# Altium project Pinger.PrjPcb
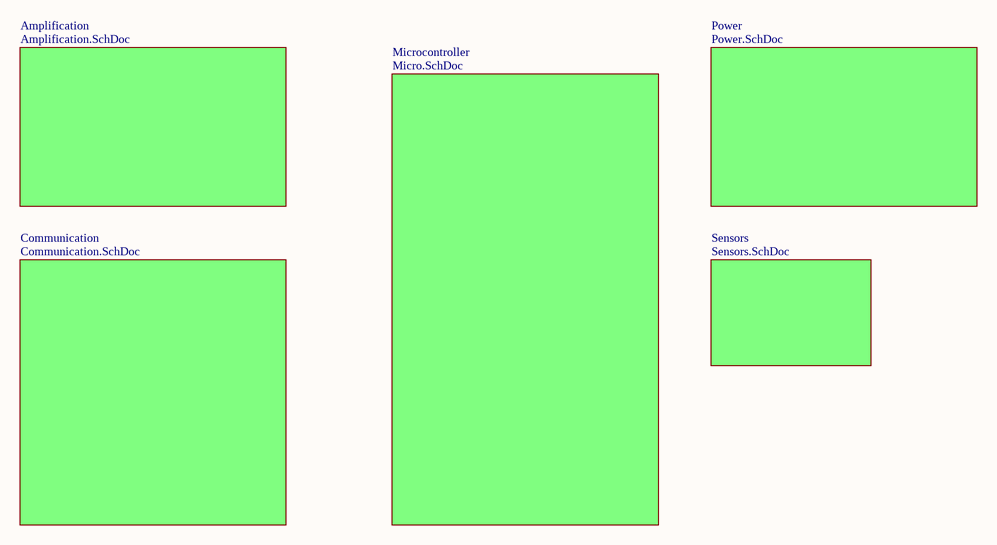
[diagram p0: Master.SchDoc]
Project: Pinger V2
6 sheets, 20 parts. Net scope: flat (ports and power ports of the same name join across sheets).
Board file: Pinger PCB Rev A.PcbDoc
Sheets:
  Master.SchDoc
    Amplification = Amplification.SchDoc
    Microcontroller = Micro.SchDoc
    Power = Power.SchDoc
    Sensors = Sensors.SchDoc
    Communication = Communication.SchDoc

## Sheet Master.SchDoc
size 431 x 279 mm; SheetNumber: 1; SheetTotal: 6

### Sub-sheets
Amplification = Amplification.SchDoc: no entries
Communication = Communication.SchDoc: no entries
Microcontroller = Micro.SchDoc: no entries
Power = Power.SchDoc: no entries
Sensors = Sensors.SchDoc: no entries

### Notes on the sheet
- DWG. NO.
- REV.
- SHT.
- THIS DOCUMENT AND THE DATA DISCLOSED HEREIN OR HEREWITH IS THE PROPERTY OF ALTIUM LIMITED AND MAY BE FREELY DISTRIBUTED IN WHOLE. NO RIGHTS ARE RESERVED OR EXPRESS OR IMPLIED WARANTEE GIVEN.
- REVISION
- DESCRIPTION
- DATE
- APPROVED
- ENG:
- APPROVALS
- PROJECT
- DSN:
- CHK:
- REFERENCE DOCUMENTS
- PROJECT REVISION:
- TITLE
- DOCUMENT REVISION:
- DESIGN ITEM:
- BOM:
- FAB DWG:
- PCB DWG:
- ASSY DWG:
- SCALE:
- SIZE
- B
- CAGE CODE
- FILE NAME
- DWG NO.
- SHEET
- OF
- REV

## Sheet Amplification.SchDoc
size 431 x 279 mm; SheetNumber: 5; SheetTotal: 6

### Notes on the sheet
- DWG. NO.
- REV.
- SHT.
- THIS DOCUMENT AND THE DATA DISCLOSED HEREIN OR HEREWITH IS THE PROPERTY OF ALTIUM LIMITED AND MAY BE FREELY DISTRIBUTED IN WHOLE. NO RIGHTS ARE RESERVED OR EXPRESS OR IMPLIED WARANTEE GIVEN.
- REVISION
- DESCRIPTION
- DATE
- APPROVED
- ENG:
- APPROVALS
- PROJECT
- DSN:
- CHK:
- REFERENCE DOCUMENTS
- PROJECT REVISION:
- TITLE
- DOCUMENT REVISION:
- DESIGN ITEM:
- BOM:
- FAB DWG:
- PCB DWG:
- ASSY DWG:
- SCALE:
- SIZE
- B
- CAGE CODE
- FILE NAME
- DWG NO.
- SHEET
- OF
- REV

## Sheet Micro.SchDoc
size 431 x 279 mm; SheetNumber: 3; SheetTotal: 6
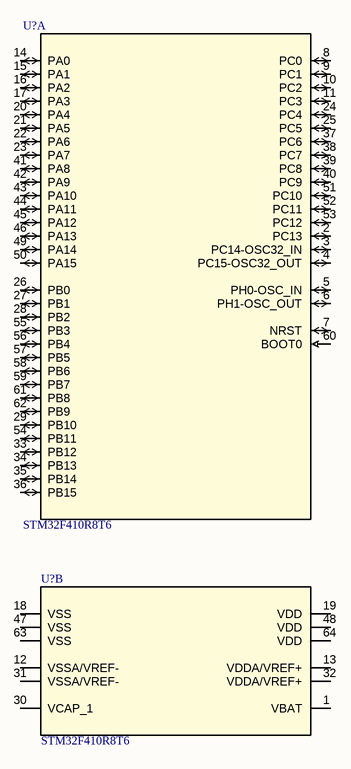
[diagram p1: Micro.SchDoc]

### Parts
(Parts that share a designator on the sheet are numbered #1, #2 ... from top to bottom, then left to right.)
U?#1  STM32F410R8T6  [STM32F410R8T6-Footprint-1]  (part A of 2)
U?#2  STM32F410R8T6  [STM32F410R8T6-Footprint-1]  (part B of 2)

### Nets

Not connected (* = marked no-connect by the designer): U?#1 2(PC13) 3(PC14-OSC32_IN) 4(PC15-OSC32_OUT) 5(PH0-OSC_IN) 6(PH1-OSC_OUT) 7(NRST) 8(PC0) 9(PC1) 10(PC2) 11(PC3) 14(PA0) 15(PA1) 16(PA2) 17(PA3) 20(PA4) 21(PA5) 22(PA6) 23(PA7) 24(PC4) 25(PC5) 26(PB0) 27(PB1) 28(PB2) 29(PB10) 33(PB12) 34(PB13) 35(PB14) 36(PB15) 37(PC6) 38(PC7) 39(PC8) 40(PC9) 41(PA8) 42(PA9) 43(PA10) 44(PA11) 45(PA12) 46(PA13) 49(PA14) 50(PA15) 51(PC10) 52(PC11) 53(PC12) 54(PB11) 55(PB3) 56(PB4) 57(PB5) 58(PB6) 59(PB7) 60(BOOT0) 61(PB8) 62(PB9); U?#2 1(VBAT) 12(VSSA/VREF-) 13(VDDA/VREF+) 18(VSS) 19(VDD) 30(VCAP_1) 31(VSSA/VREF-) 32(VDDA/VREF+) 47(VSS) 48(VDD) 63(VSS) 64(VDD)

### Notes on the sheet
- DWG. NO.
- REV.
- SHT.
- THIS DOCUMENT AND THE DATA DISCLOSED HEREIN OR HEREWITH IS THE PROPERTY OF ALTIUM LIMITED AND MAY BE FREELY DISTRIBUTED IN WHOLE. NO RIGHTS ARE RESERVED OR EXPRESS OR IMPLIED WARANTEE GIVEN.
- REVISION
- DESCRIPTION
- DATE
- APPROVED
- ENG:
- APPROVALS
- PROJECT
- DSN:
- CHK:
- REFERENCE DOCUMENTS
- PROJECT REVISION:
- TITLE
- DOCUMENT REVISION:
- DESIGN ITEM:
- BOM:
- FAB DWG:
- PCB DWG:
- ASSY DWG:
- SCALE:
- SIZE
- B
- CAGE CODE
- FILE NAME
- DWG NO.
- SHEET
- OF
- REV

### Library data of the parts
U?#1 U?#2 = CMP-00059-1: MCU 32-bit ARM Cortex M4 RISC 64KB Flash 3.3V 64-Pin LQFP Frame; Frequency: 100MHz; Number of I/Os: 50; Interface: I2C,SPI,IrDA,UART,USART; Peripherals: Brown-out Detect/Reset,POR,PWM,WDT,DMA; Oscillator Type: Internal; Series: STM32F4; Memory Type: FLASH; Min Operating Temperature: -40°C; Case/Package: LQFP; Packaging: Tray; Memory Size: 64KB; Core Architecture: ARM; RoHS Compliant: Yes; Max Operating Temperature: 85°C

## Sheet Power.SchDoc
size 431 x 279 mm; SheetNumber: 2; SheetTotal: 6
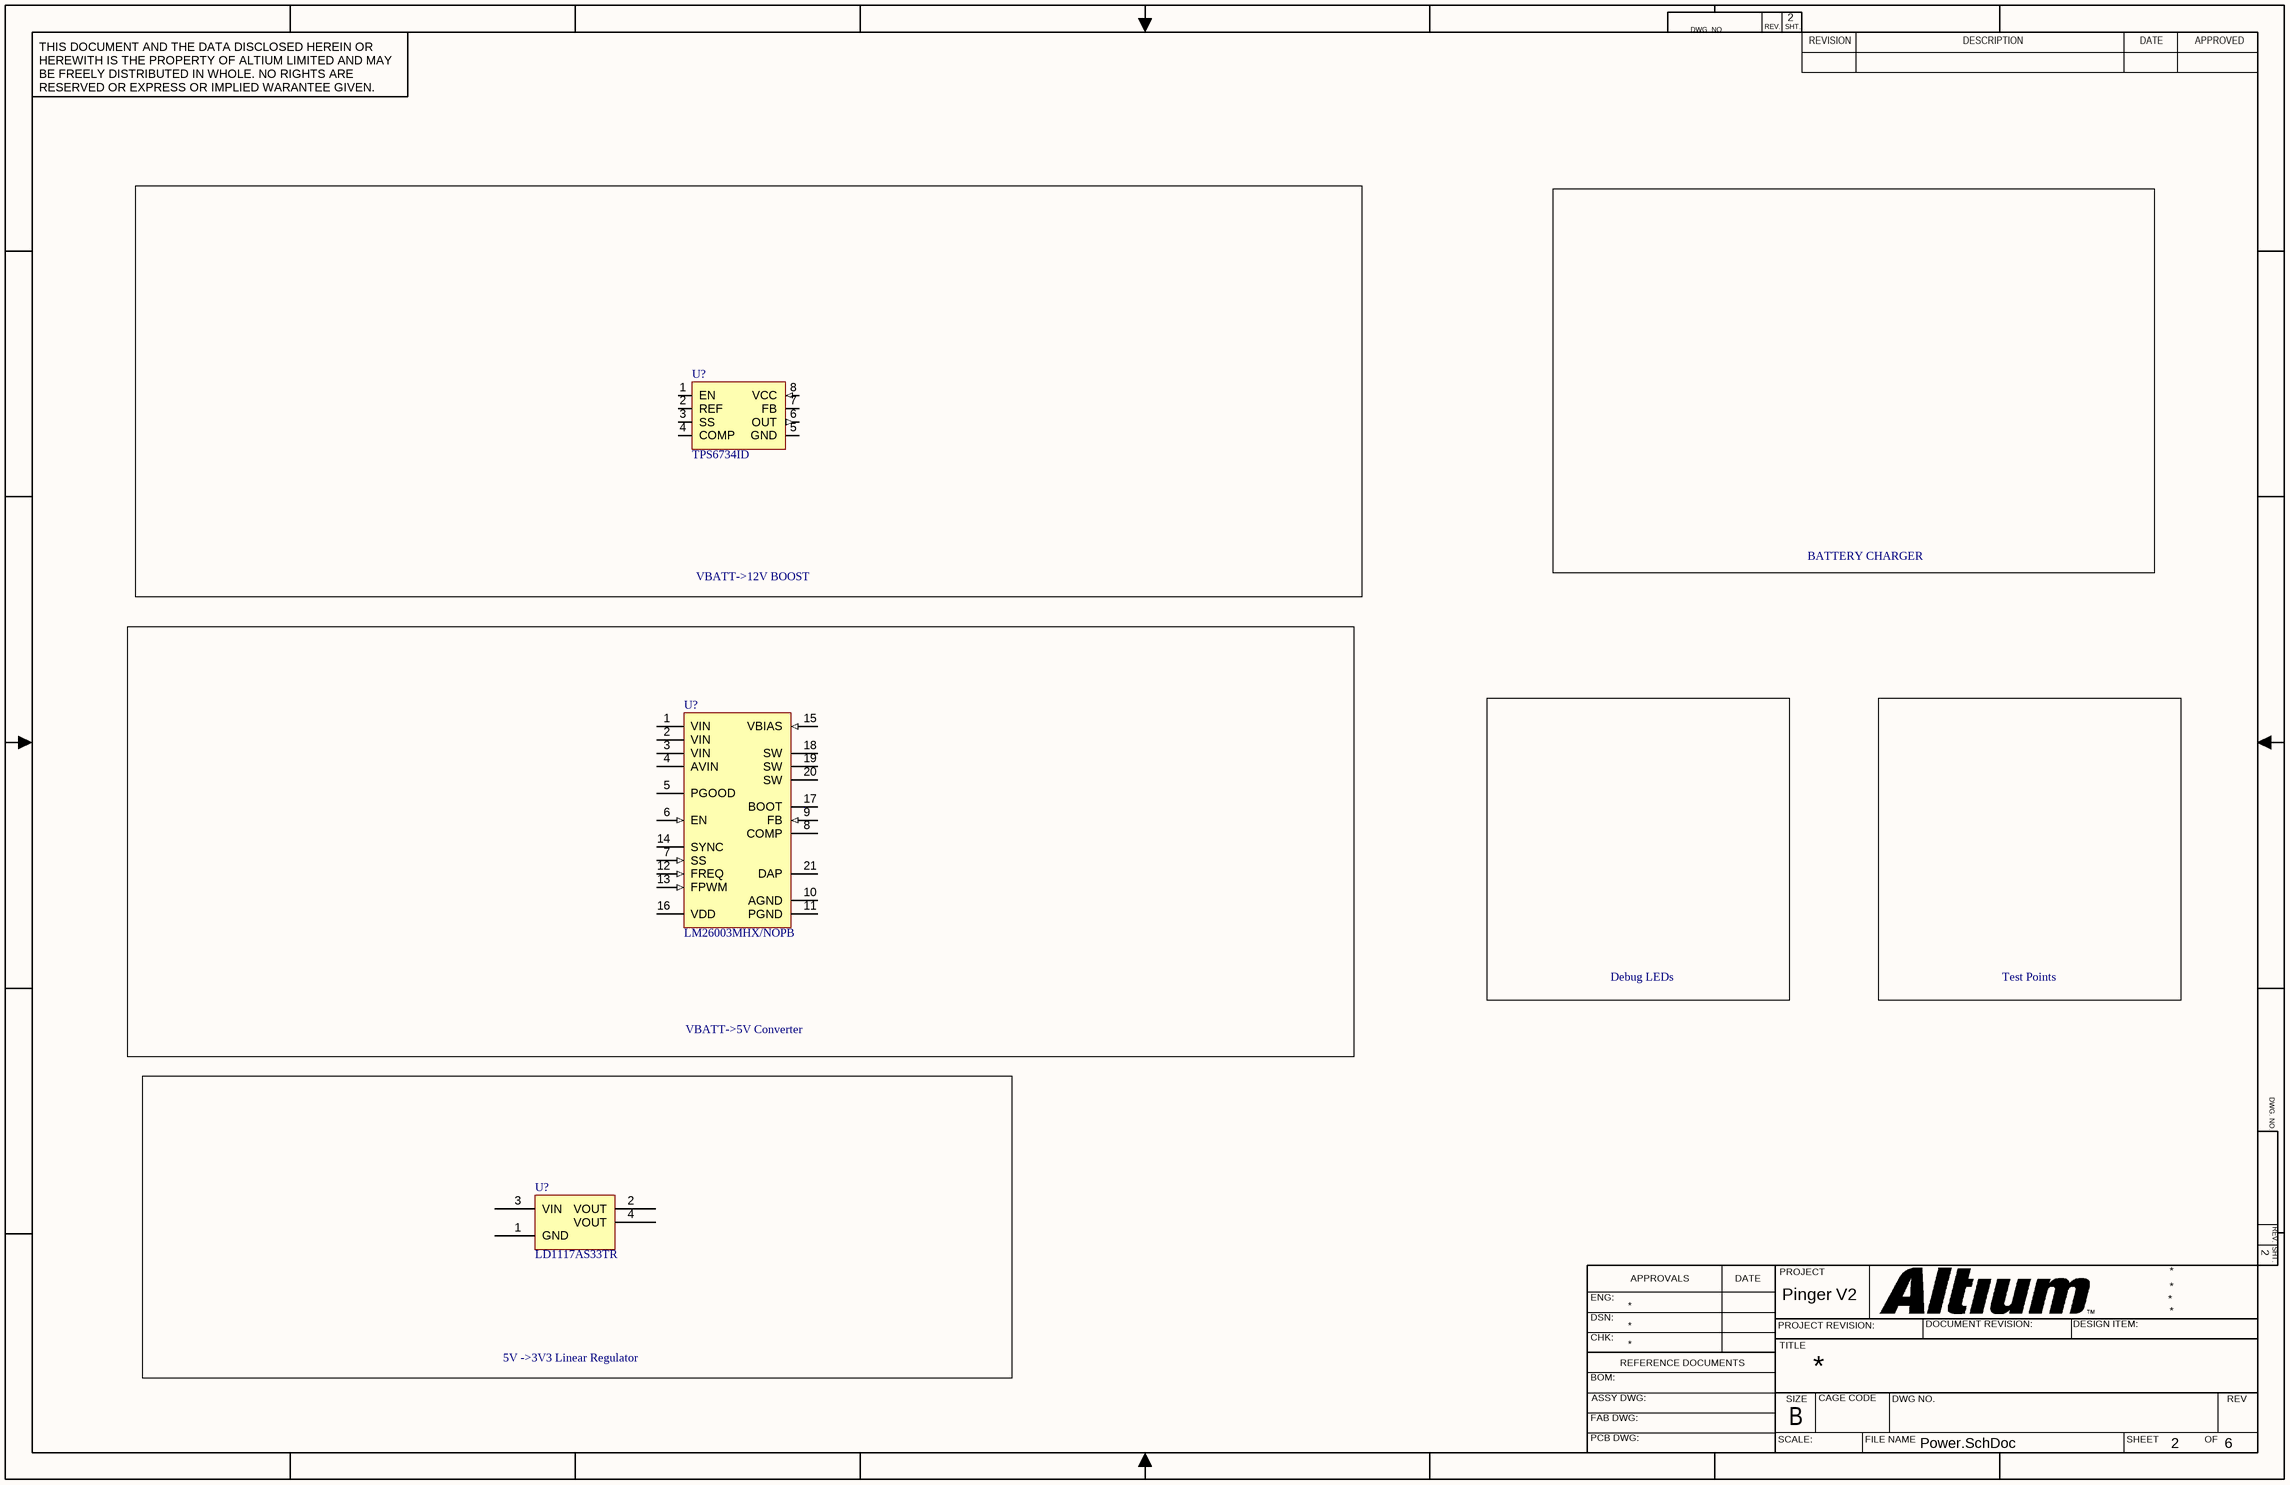
[diagram p2: Power.SchDoc]

### Parts
(Parts that share a designator on the sheet are numbered #1, #2 ... from top to bottom, then left to right.)
U?#3  TPS6734ID  [TI SOIC-8 D]
U?#4  LM26003MHX/NOPB  [PWP0020A_L]
U?#5  LD1117AS33TR  [ST SOT-223]

### Blocks framed on the sheet
VBATT->12V BOOST: U?#3
VBATT->5V Converter: U?#4
5V ->3V3 Linear Regulator: U?#5

### Nets

Not connected (* = marked no-connect by the designer): U?#3 1(EN) 2(REF) 3(SS) 4(COMP) 5(GND) 6(OUT) 7(FB) 8(VCC); U?#4 1(VIN) 2(VIN) 3(VIN) 4(AVIN) 5(PGOOD) 6(EN) 7(SS) 8(COMP) 9(FB) 10(AGND) 11(PGND) 12(FREQ) 13(FPWM) 14(SYNC) 15(VBIAS) 16(VDD) 17(BOOT) 18(SW) 19(SW) 20(SW) 21(DAP); U?#5 1(GND) 2(VOUT) 3(VIN) 4(VOUT)

### Notes on the sheet
- BATTERY CHARGER
- Debug LEDs
- Test Points
- DWG. NO.
- REV.
- SHT.
- THIS DOCUMENT AND THE DATA DISCLOSED HEREIN OR HEREWITH IS THE PROPERTY OF ALTIUM LIMITED AND MAY BE FREELY DISTRIBUTED IN WHOLE. NO RIGHTS ARE RESERVED OR EXPRESS OR IMPLIED WARANTEE GIVEN.
- REVISION
- DESCRIPTION
- DATE
- APPROVED
- ENG:
- APPROVALS
- PROJECT
- DSN:
- CHK:
- REFERENCE DOCUMENTS
- PROJECT REVISION:
- TITLE
- DOCUMENT REVISION:
- DESIGN ITEM:
- BOM:
- FAB DWG:
- PCB DWG:
- ASSY DWG:
- SCALE:
- SIZE
- B
- CAGE CODE
- FILE NAME
- DWG NO.
- SHEET
- OF
- REV

### Library data of the parts
U?#3 = CMP-001-0000-2: Switching Regulator, Current-Mode, 1.5A, 170kHz Switching Freq-Max, CMOS, PDSO8; Min Input Voltage: 2.7V; Efficiency: 86%; Max Output Current: 150mA; Nominal Supply Current: 2.5mA; Max Output Voltage: 12.6V; Output Configuration: Positive; Number of Outputs: 1; Output Voltage: 12.12V; Output Type: Fixed; Topology: Boost; Nominal Output Voltage: 12V; Output Power: 725mW; Synchronous Rectifier: No; Height: 1.58mm; Width: 3.91mm; Length: 4.9mm; RoHS Compliant: Yes; Switching Frequency: 170kHz; Max Operating Temperature: 85°C; Number of Pins: 8; Packaging: Rail/Tube; Radiation Hardening: No; Mount: Surface Mount; Output Current: 150mA; Reach SVHC Compliant: Yes; Min Output Voltage: 12.12V; Weight: 0.002677oz; Min Operating Temperature: -40°C; Package Quantity: 75; Lead Free: Lead Free; Operating Supply Voltage: 12V; Max Input Voltage: 12V; Series: -; Case/Package: SOIC
U?#4 = CMP-0069-01745-3: 3A Switching Regulator with High Efficiency Sleep Mode, 20-pin TSSOP-EP, Pb-Free; Manufacturer: Texas Instruments; CompType: Switcher; PackageTopMarking: NSUZXYTT*LM26003*MH; PowerWise: Y; PackageDescription: Molded TSSOP, Jedec, 6.5 x 4.4 x 0.9mm Body, 20 Lead, 0.65mm Pitch, Exposed Pad; Code_JEDEC: MO-153-ACT; PinCount: 20; ComponentLink1URL: http://www.ti.com/general/docs/lit/getliterature.tsp?genericPartNumber=LM26003&fileType=pdf; PackageReference: PWP0020A; RoHS: Y; ComponentLink1Description: Datasheet URL
U?#5 = LD1117AS33TR: IC REG LINEAR 3.3V 1A SOT223; Manufacturer: STMicroelectronics; Current - Quiescent (Iq): 10 mA; Number of Regulators: 1; Output Configuration: Positive; Output Type: Fixed; Protection Features: Over Current, Over Temperature; PSRR: 75dB (120Hz); Voltage Dropout (Max): 1.3V @ 1A; Voltage - Input (Max): 15V; Part Number: LD1117AS33TR; ComponentLink1Description: Datasheet; ComponentLink1URL: http://www.st.com/content/ccc/resource/technical/document/datasheet/a5/c3/3f/c9/2b/15/40/49/CD00002116.pdf/files/CD00002116.pdf/jcr:content/translations/en.CD00002116.pdf; ComponentLink2Description: DigiKey Link; ComponentLink2URL: https://www.digikey.com/en/products/detail/stmicroelectronics/LD1117AS33TR/585752; Current - Output: 1A; LastUpdated: 2022-09-19 1:59:38 PM; Lifecycle Status: Active; Minimum Order: 1; Mounting Type: Surface Mount; Operating Temperature: 0°C ~ 125°C; Package / Case: TO-261-4, TO-261AA; Packaging: TapeAndReel; Part Status: Active; Price: 0.45; Series: -; Supplier 1: DigiKey; Supplier Part Number 1: 497-1228-1-ND; Supplier Device Package: SOT-223; Voltage - Output (Min/Fixed): 3.3V

## Sheet Sensors.SchDoc
size 431 x 279 mm; SheetNumber: 6; SheetTotal: 6

### Notes on the sheet
- DWG. NO.
- REV.
- SHT.
- THIS DOCUMENT AND THE DATA DISCLOSED HEREIN OR HEREWITH IS THE PROPERTY OF ALTIUM LIMITED AND MAY BE FREELY DISTRIBUTED IN WHOLE. NO RIGHTS ARE RESERVED OR EXPRESS OR IMPLIED WARANTEE GIVEN.
- REVISION
- DESCRIPTION
- DATE
- APPROVED
- ENG:
- APPROVALS
- PROJECT
- DSN:
- CHK:
- REFERENCE DOCUMENTS
- PROJECT REVISION:
- TITLE
- DOCUMENT REVISION:
- DESIGN ITEM:
- BOM:
- FAB DWG:
- PCB DWG:
- ASSY DWG:
- SCALE:
- SIZE
- B
- CAGE CODE
- FILE NAME
- DWG NO.
- SHEET
- OF
- REV

## Sheet Communication.SchDoc
size 431 x 279 mm; SheetNumber: 4; SheetTotal: 6
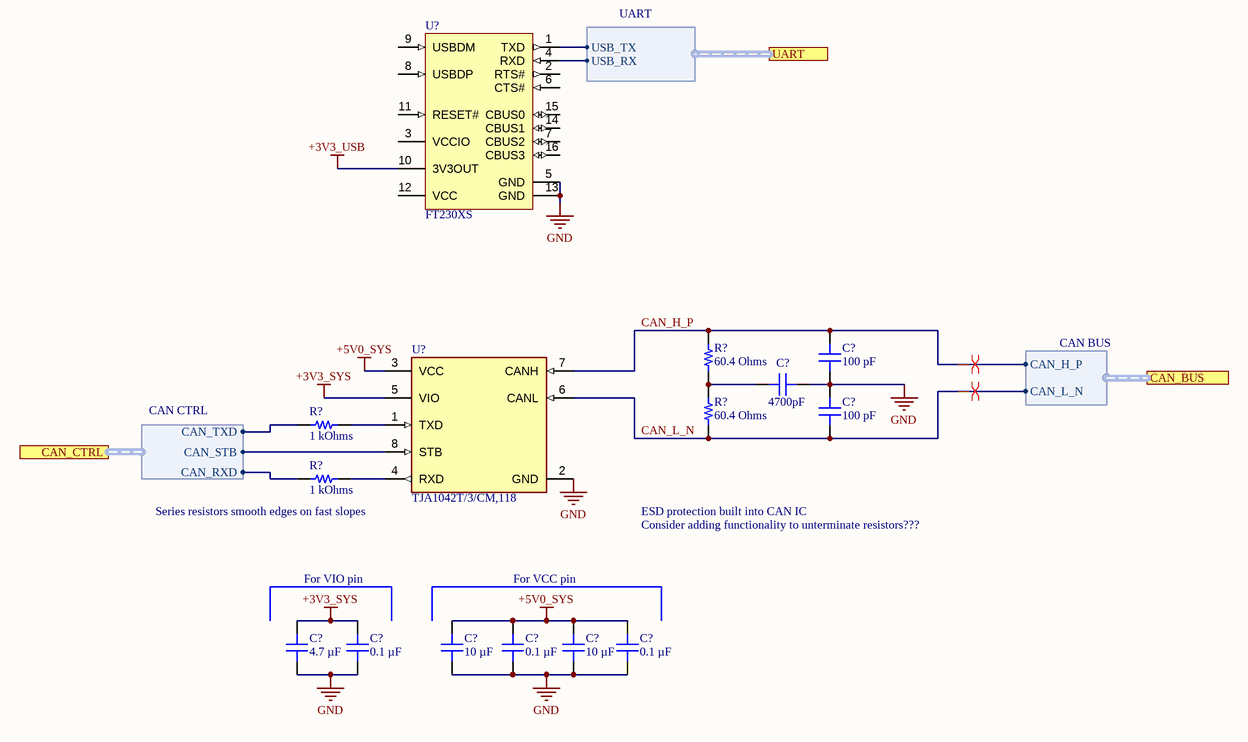
[diagram p3: Communication.SchDoc]

### Parts
(Parts that share a designator on the sheet are numbered #1, #2 ... from top to bottom, then left to right.)
C?#1  100 pF  [CAP 0603_1608]
C?#2  4700pF  [CAP 0603_1608]
C?#3  100 pF  [CAP 0603_1608]
C?#4  4.7 µF  [CAP 0603_1608]
C?#5  0.1 µF  [CAP 0603_1608]
C?#6  10 µF  [CAP 0805_2012]
C?#7  0.1 µF  [CAP 0603_1608]
C?#8  10 µF  [CAP 0805_2012]
C?#9  0.1 µF  [CAP 0603_1608]
R?#1  60.4 Ohms  [RES 0603_1608]
R?#2  60.4 Ohms  [RES 0603_1608]
R?#3  1 kOhms  [RES 0603_1608]
R?#4  1 kOhms  [RES 0603_1608]
U?#6  FT230XS  [FTDI-SSOP-16_L]
U?#7  TJA1042T/3/CM,118  [FP-SOT96-1-IPC_A]

### Ports
CAN_BUS (harness CAN BUS), CAN_CTRL (harness CAN CTRL), UART (harness UART)

### Harnesses
UART: USB_RX, USB_TX
CAN BUS: CAN_H_P, CAN_L_N
CAN CTRL: CAN_RXD, CAN_TXD, CAN_STB

### Nets
+3V3_SYS: C?#4.2 C?#5.2 U?#7.5(VIO)
+3V3_USB: U?#6.10(3V3OUT)
+5V0_SYS: C?#6.2 C?#7.2 C?#8.2 C?#9.2 U?#7.3(VCC)
GND: C?#1.2 C?#2.2 C?#3.1 C?#4.1 C?#5.1 C?#6.1 C?#7.1 C?#8.1 C?#9.1 U?#6.5(GND) U?#6.13(GND) U?#7.2(GND)
CAN_H_P: C?#1.1 R?#1.2 U?#7.7(CANH) ; port CAN_BUS.CAN_H_P
CAN_L_N: C?#3.2 R?#2.1 U?#7.6(CANL) ; port CAN_BUS.CAN_L_N
NetC?#2_1: C?#2.1 R?#1.1 R?#2.2
NetR?#3_1: R?#3.1 ; port CAN_CTRL.CAN_TXD
NetR?#3_2: R?#3.2 U?#7.1(TXD)
NetR?#4_1: R?#4.1 ; port CAN_CTRL.CAN_RXD
NetR?#4_2: R?#4.2 U?#7.4(RXD)
NetU?#6_1: U?#6.1(TXD) ; port UART.USB_TX
NetU?#6_4: U?#6.4(RXD) ; port UART.USB_RX
NetU?#7_8: U?#7.8(STB) ; port CAN_CTRL.CAN_STB

Not connected (* = marked no-connect by the designer): U?#6 2(RTS#) 3(VCCIO) 6(CTS#) 7(CBUS2) 8(USBDP) 9(USBDM) 11(RESET#) 12(VCC) 14(CBUS1) 15(CBUS0) 16(CBUS3)

### Layout directives
differential pair: CAN_H_P, CAN_L_N

### Notes on the sheet
- Series resistors smooth edges on fast slopes
- ESD protection built into CAN IC
- Consider adding functionality to unterminate resistors???
- (near C?#5) For VIO pin
- (near C?#7) For VCC pin
- DWG. NO.
- REV.
- SHT.
- THIS DOCUMENT AND THE DATA DISCLOSED HEREIN OR HEREWITH IS THE PROPERTY OF ALTIUM LIMITED AND MAY BE FREELY DISTRIBUTED IN WHOLE. NO RIGHTS ARE RESERVED OR EXPRESS OR IMPLIED WARANTEE GIVEN.
- REVISION
- DESCRIPTION
- DATE
- APPROVED
- ENG:
- APPROVALS
- PROJECT
- DSN:
- CHK:
- REFERENCE DOCUMENTS
- PROJECT REVISION:
- TITLE
- DOCUMENT REVISION:
- DESIGN ITEM:
- BOM:
- FAB DWG:
- PCB DWG:
- ASSY DWG:
- SCALE:
- SIZE
- B
- CAGE CODE
- FILE NAME
- DWG NO.
- SHEET
- OF
- REV

### Library data of the parts
C?#1 C?#3 = C0603C101K5GACAUTO: CAP CER 100PF 50V C0G/NP0 0603; manufacturer: KEMET; Temperature Coefficient: C0G, NP0; Tolerance: ±10%; Part Number: C0603C101K5GACAUTO; Value: 100 pF; Applications: Automotive; Capacitance: 100 pF; componentlink1description: Datasheet; componentlink1url: https://api.kemet.com/component-edge/download/datasheet/C0603C101K5GACAUTO.pdf; componentlink2description: DigiKey Link; componentlink2url: https://www.digikey.com/en/products/detail/kemet/C0603C101K5GACAUTO/3314842; Device Package: 0603 (1608 Metric); Features: Low ESL; lastupdated: 2022-09-19 1:01:20 PM; Lifecycle Status: Active; Minimum Order: 1; Mounting Type: Surface Mount, MLCC; Operating Temperature: -55°C ~ 125°C; Package / Case: 0603 (1608 Metric); packaging: TapeAndReel; partid: 2201; Part Status: Active; price: 0.01; Ratings: AEC-Q200; series: SMD Auto C0G; Size / Dimension: 0.063" L x 0.031" W (1.60mm x 0.80mm); Supplier 1: DigiKey; Supplier Part Number 1: 399-6843-1-ND; Thickness (Max): 0.034" (0.87mm); Voltage - Rated: 50V
C?#2 = 06031C472KAZ2A: CAP CER 4700PF 100V X7R 0603; manufacturer: AVX Corporation; Tolerance: ±10%; Part Number: 06031C472KAZ2A; Value: 4700pF; Applications: Boardflex Sensitive; Capacitance: 4700pF; componentlink1description: Datasheet; componentlink1url: http://datasheets.avx.com/FlexitermMLCC.pdf; componentlink2description: DigiKey Link; componentlink2url: http://digikey.com/product-detail/en/avx-corporation/06031C472KAZ2A/478-10224-1-ND/6797224; Device Package: 0603 (1608 Metric); Features: Soft Termination; lastupdated: 2020-09-02 1:03:34 AM; Lifecycle Status: Active; Minimum Order: 1; Mounting Type: Surface Mount, MLCC; Operating Temperature: -55°C ~ 125°C; Package / Case: 0603 (1608 Metric); packaging: TapeAndReel; partid: 3253; Part Status: Active; price: 0.05; series: FLEXITERM®; Size / Dimension: 0.063" L x 0.032" W (1.60mm x 0.81mm); Supplier 1: DigiKey; Supplier Part Number 1: 478-10224-1-ND; Temperature Coefficient: X7R; Thickness (Max): 0.035" (0.90mm); Voltage - Rated: 100V
C?#4 = CL10A475KA8NQNC: CAP CER 4.7UF 25V X5R 0603; manufacturer: Samsung Electro-Mechanics; Tolerance: ±10%; Part Number: CL10A475KA8NQNC; Value: 4.7 µF; Applications: General Purpose; Capacitance: 4.7 µF; componentlink1description: Datasheet; componentlink1url: http://www.samsungsem.com/kr/support/product-search/mlcc/CL10A475KA8NQNC.jsp; componentlink2description: DigiKey Link; componentlink2url: https://www.digikey.com/en/products/detail/samsung-electro-mechanics/CL10A475KA8NQNC/3887558; Device Package: 0603 (1608 Metric); lastupdated: 2022-09-19 1:01:20 PM; Lifecycle Status: Active; Minimum Order: 1; Mounting Type: Surface Mount, MLCC; Operating Temperature: -55°C ~ 85°C; Package / Case: 0603 (1608 Metric); packaging: TapeAndReel; partid: 2349; Part Status: Active; price: 0.06; series: CL; Size / Dimension: 0.063" L x 0.031" W (1.60mm x 0.80mm); Supplier 1: DigiKey; Supplier Part Number 1: 1276-1900-1-ND; Temperature Coefficient: X5R; Thickness (Max): 0.035" (0.90mm); Voltage - Rated: 25V
C?#5 C?#7 C?#9 = CGA3E2X7R1H104K080AE: CAP CER 0.1UF 50V X7R 0603; manufacturer: TDK Corporation; Tolerance: ±10%; Part Number: CGA3E2X7R1H104K080AE; Value: 0.1 µF; Applications: Automotive, Boardflex Sensitive; Capacitance: 0.1 µF; componentlink1description: Datasheet; componentlink1url: https://product.tdk.com/info/en/catalog/datasheets/mlcc_automotive_soft_en.pdf?ref_disty=digikey; componentlink2description: DigiKey Link; componentlink2url: https://www.digikey.com/en/products/detail/tdk-corporation/CGA3E2X7R1H104K080AE/4490594; Device Package: 0603 (1608 Metric); Features: Soft Termination; lastupdated: 2022-09-19 1:01:18 PM; Lifecycle Status: Active; Minimum Order: 1; Mounting Type: Surface Mount, MLCC; Operating Temperature: -55°C ~ 125°C; Package / Case: 0603 (1608 Metric); packaging: TapeAndReel; partid: 2715; Part Status: Active; price: 0.01; Ratings: AEC-Q200; series: CGA; Size / Dimension: 0.063" L x 0.031" W (1.60mm x 0.80mm); Supplier 1: DigiKey; Supplier Part Number 1: 445-15957-1-ND; Temperature Coefficient: X7R; Thickness (Max): 0.037" (0.95mm); Voltage - Rated: 50V
C?#6 C?#8 = C2012X5R1E106K125AB: CAP CER 10UF 25V X5R 0805; manufacturer: TDK Corporation; Tolerance: ±10%; Part Number: C2012X5R1E106K125AB; Value: 10 µF; Applications: General Purpose; Capacitance: 10 µF; componentlink1description: Datasheet; componentlink1url: https://product.tdk.com/info/en/catalog/datasheets/mlcc_commercial_general_en.pdf?ref_disty=digikey; componentlink2description: DigiKey Link; componentlink2url: https://www.digikey.com/en/products/detail/tdk-corporation/C2012X5R1E106K125AB/2443462; Device Package: 0805 (2012 Metric); Features: Low ESL; lastupdated: 2022-09-19 1:04:20 PM; Lifecycle Status: Active; Minimum Order: 1; Mounting Type: Surface Mount, MLCC; Operating Temperature: -55°C ~ 85°C; Package / Case: 0805 (2012 Metric); packaging: TapeAndReel; partid: 4850; Part Status: Active; price: 0.06; series: C; Size / Dimension: 0.079" L x 0.049" W (2.00mm x 1.25mm); Supplier 1: DigiKey; Supplier Part Number 1: 445-5984-1-ND; Temperature Coefficient: X5R; Thickness (Max): 0.057" (1.45mm); Voltage - Rated: 25V
R?#1 R?#2 = RK73H1JTTD60R4F: RES 60.4 OHM 1% 1/8W 0603; Manufacturer: KOA Speer Electronics, Inc.; Power (Watts): 0.125W, 1/8W; Temperature Coefficient: ±100ppm/°C; Part Number: RK73H1JTTD60R4F; Value: 60.4 Ohms; ComponentLink1Description: Datasheet; ComponentLink1URL: http://www.koaspeer.com/catimages/Products/RK73H/RK73H.pdf; ComponentLink2Description: DigiKey Link; ComponentLink2URL: https://www.digikey.com/en/products/detail/koa-speer-electronics-inc/RK73H1JTTD60R4F/9845016; Composition: Thick Film; Device Package: 0603 (1608 Metric); Features: Automotive AEC-Q200, Moisture Resistant; Height - Seated (Max): 0.022" (0.55mm); LastUpdated: 2022-09-19 1:22:33 PM; Lifecycle Status: Active; Minimum Order: 1; Number of Terminations: 2; Operating Temperature: -55°C ~ 155°C; Package / Case: 0603 (1608 Metric); Packaging: CutTape; PartId: 5191; Part Status: Active; Price: 0.01; Ratings: AEC-Q200; Resistance: 60.4 Ohms; Series: RK73H; Size / Dimension: 0.063" L x 0.031" W (1.60mm x 0.80mm); Supplier 1: DigiKey; Supplier Part Number 1: 2019-RK73H1JTTD60R4FCT-ND; Supplier Device Package: 0603; Tolerance: ±1%
R?#3 R?#4 = RT0603FRE071KL: RES SMD 1K OHM 1% 1/10W 0603; Manufacturer: Yageo; Power (Watts): 0.1W, 1/10W; Temperature Coefficient: ±50ppm/°C; Part Number: RT0603FRE071KL; Value: 1 kOhms; ComponentLink1Description: Datasheet; ComponentLink1URL: https://www.yageo.com/upload/media/product/productsearch/datasheet/rchip/PYu-RT_1-to-0.01_RoHS_L_11.pdf; ComponentLink2Description: DigiKey Link; ComponentLink2URL: https://www.digikey.com/en/products/detail/yageo/RT0603FRE071KL/1075188; Composition: Thin Film; Device Package: 0603 (1608 Metric); Height - Seated (Max): 0.022" (0.55mm); LastUpdated: 2022-09-19 1:22:31 PM; Lifecycle Status: Active; Minimum Order: 1; Number of Terminations: 2; Operating Temperature: -55°C ~ 155°C; Package / Case: 0603 (1608 Metric); Packaging: TapeAndReel; PartId: 5672; Part Status: Active; Price: 0.01; Resistance: 1 kOhms; Series: RT; Size / Dimension: 0.063" L x 0.031" W (1.60mm x 0.80mm); Supplier 1: DigiKey; Supplier Part Number 1: YAG2323CT-ND; Supplier Device Package: 0603; Tolerance: ±1%
U?#6 = CMP-2000-06288-1: USB to Basic UART IC, 2.97 to 5.5 V, -40 to 85 degC, 16-Pin SSOP, RoHS; Manufacturer: FTDI; Data Rate: 3Mbaud; USB Standard: USB2.0; USB Type: Transceiver; No. of Pins: 16Pins; Supply Voltage Max: 5.5V; SVHC: NoSVHC(17-Dec-2015); Supply Voltage Min: 2.97V; MSL: MSL3-168hours; Datasheet Version: Rev. 1.4, 05/2016; Interface Case Style: SSOP; Datasheet URL: http://www.ftdichip.com/Support/Documents/DataSheets/ICs/DS_FT230X.pdf; Packaging: CutTape; Package Description: 16-Pin Shrink Small Outline Package Integrated Circuit, Body 4.9 x 3.9 mm, Pitch 0.635 mm; Operating Temperature Min: -40°C; Mounting Technology: SurfaceMount; Package Reference: SSOP-16; Manufacturer URL: http://www.ftdichip.com/; Product Range: -; Operating Temperature Max: 85°C; No. of Ports: -
U?#7 = CMP-10098-000021-1: IC TRANSCEIVER HALF 1/1 8SO; Min Supply Voltage: 4.5V; Operating Supply Voltage: 5V; Data Rate: 1Mbps; Number of Transceivers: 1; Nominal Supply Current: 70mA; Max Supply Voltage: 5.5V; Mount: Surface Mount; Contact Plating: Gold; Max Operating Temperature: 150°C; Case/Package: SO; Lead Free: Lead Free; Max Supply Current: 70mA; Number of Pins: 8; Packaging: Tape and Reel; Radiation Hardening: No; Package Quantity: 2500; Min Operating Temperature: -40°C

## Assembly variants
Pinger PCBA Rev A: all parts fitted